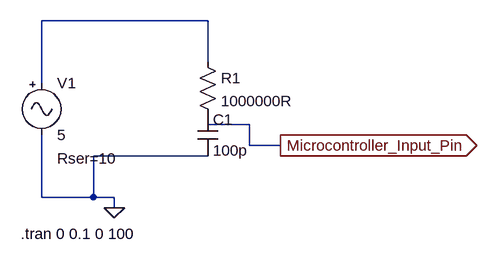
[diagram p0: schematic capacitor meter.asc]
capacitor meter.asc, the LTspice schematic file:
Version 4
SHEET 1 880 680
WIRE 144 32 -112 32
WIRE 144 96 144 32
WIRE -112 128 -112 32
WIRE 208 192 144 192
WIRE 208 224 208 192
WIRE 256 224 208 224
WIRE 144 240 -32 240
WIRE -112 304 -112 208
WIRE -32 304 -32 240
WIRE -32 304 -112 304
WIRE 0 304 -32 304
WIRE 0 320 0 304
FLAG 0 320 0
FLAG 256 224 Microcontroller_Input_Pin
IOPIN 256 224 Out
SYMBOL Misc\\signal -112 112 R0
WINDOW 123 0 0 Left 0
WINDOW 39 24 132 Left 2
SYMATTR InstName V1
SYMATTR Value 5
SYMATTR SpiceLine Rser=10
SYMBOL res 128 80 R0
SYMATTR InstName R1
SYMATTR Value 1000000R
SYMBOL cap 128 176 R0
SYMATTR InstName C1
SYMATTR Value 100p
TEXT -144 360 Left 2 !.tran 0 0.1 0 100

The netlist it stands for:
* capacitor meter.asc
V1 N001 0 5 Rser=10
R1 N001 P001 1000000R
C1 P001 0 100p
.tran 0 0.1 0 100
.backanno
.end